# Altium schematic sheet MicroMultimeter__Sch.SchDoc: MicroMultimeter
size 228 x 152 mm; Author: Hom; CompanyName: KitSprout; DrawnBy: Hom; Engineer: Hom; Organization: KitSprout; Revision: B; SheetNumber: 1; SheetTotal: 1; License: CC BY-SA 4.0; Version: 1.0; LibVersion: 1.3; PageSetup: Record=PageOptions|CenterHorizontal=True|CenterVertical=True|PrintScale=1.00|XCorrection=1.00|YCorrection=1.00|PrintKind=0|BorderSize=5000000|LeftOffset=0|BottomOffset=0|Orientation=2|PaperLength=1000|PaperWidth=1000|Scale=100|PaperSource=7|PrintQuality=-3|MediaType=1|DitherType=10|PrintScaleMode=0|PaperKind=A4|PaperIndex=9
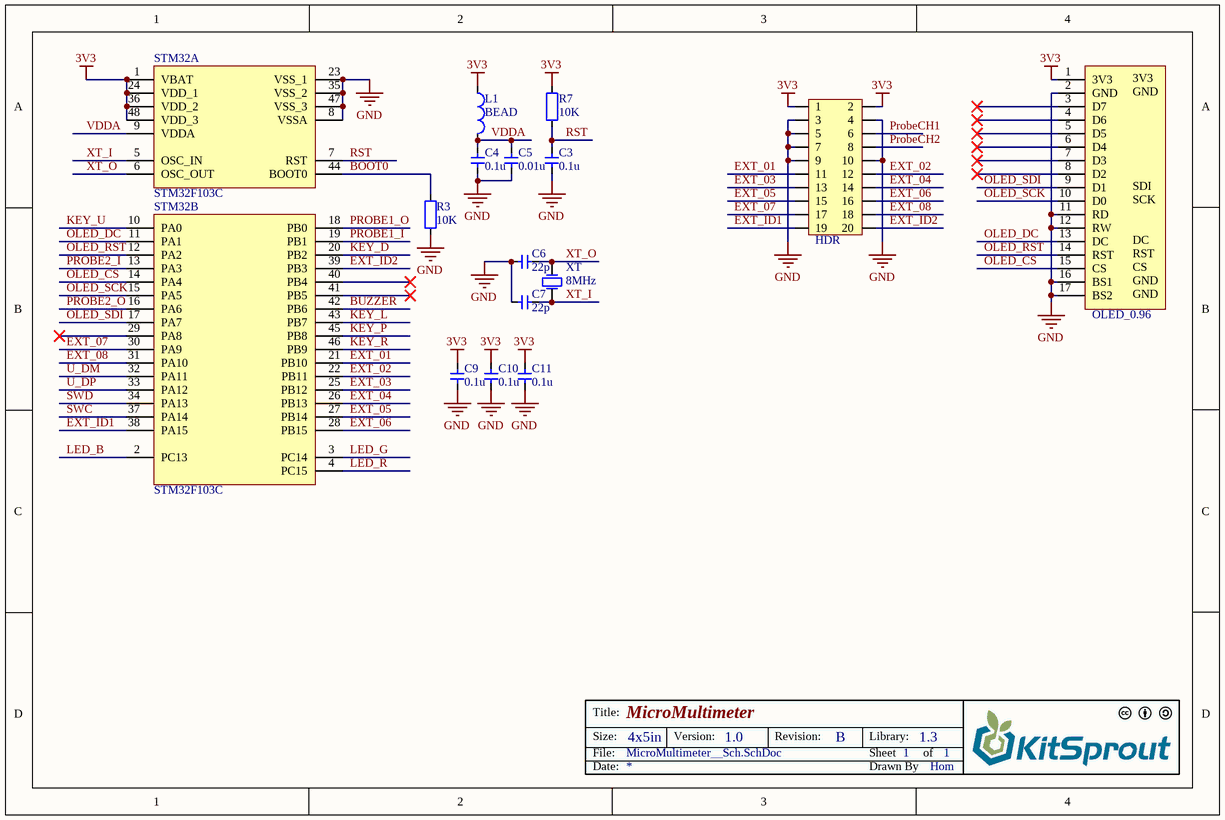
[diagram p0: MicroMultimeter__Sch.SchDoc]

## Parts
C3  value 0.1u  [CAP_0603]  (hidden comment: Cap_0603)
C4  value 0.1u  [CAP_0603]  (hidden comment: Cap_0603)
C5  value 0.01u  [CAP_0603]  (hidden comment: Cap_0603)
C6  value 22p  [CAP_0603]  (hidden comment: Cap_0603)
C7  value 22p  [CAP_0603]  (hidden comment: Cap_0603)
C9  value 0.1u  [CAP_0603]  (hidden comment: Cap_0603)
C10  value 0.1u  [CAP_0603]  (hidden comment: Cap_0603)
C11  value 0.1u  [CAP_0603]  (hidden comment: Cap_0603)
HDR  HDR2x10_2.54  [HDR2X10_2.54_180HF]  (value not drawn)
L1  value BEAD  [IND_0603]  (hidden comment: Ind_0603)
OLED_0.96  OLED_0.96  [OLED_0.96_96x64]  (value not drawn)
R3  value 10K  [RES_0603]  (hidden comment: Res_0603)
R7  value 10K  [RES_0603]  (hidden comment: Res_0603)
STM32  STM32F103C  [LQFP_P0.5_48]  (parts A,B of 2)
XT  value 8MHz  [XT_5032_2]  (hidden comment: XTAL_5032_2P)

## Nets
3V3: C9.2 C10.2 C11.2 HDR.1 HDR.2 L1.1 OLED_0.96.1(3V3) R7.2 STM32.1(VBAT) STM32.24(VDD_1) STM32.36(VDD_2) STM32.48(VDD_3)
GND: C3.1 C4.1 C5.1 C6.2 C7.2 C9.1 C10.1 C11.1 HDR.3 HDR.4 HDR.5 HDR.7 HDR.9 HDR.10 OLED_0.96.2(GND) OLED_0.96.11(RD) OLED_0.96.12(RW) OLED_0.96.16(BS1) OLED_0.96.17(BS2) R3.1 STM32.8(VSSA) STM32.23(VSS_1) STM32.35(VSS_2) STM32.47(VSS_3)
BOOT0: R3.2 STM32.44(BOOT0)
BUZZER: STM32.42(PB6)
EXT_01: HDR.11 STM32.21(PB10)
EXT_02: HDR.12 STM32.22(PB11)
EXT_03: HDR.13 STM32.25(PB12)
EXT_04: HDR.14 STM32.26(PB13)
EXT_05: HDR.15 STM32.27(PB14)
EXT_06: HDR.16 STM32.28(PB15)
EXT_07: HDR.17 STM32.30(PA9)
EXT_08: HDR.18 STM32.31(PA10)
EXT_ID1: HDR.19 STM32.38(PA15)
EXT_ID2: HDR.20 STM32.39(PB3)
KEY_D: STM32.20(PB2)
KEY_L: STM32.43(PB7)
KEY_P: STM32.45(PB8)
KEY_R: STM32.46(PB9)
KEY_U: STM32.10(PA0)
LED_B: STM32.2(PC13)
LED_G: STM32.3(PC14)
LED_R: STM32.4(PC15)
OLED_CS: OLED_0.96.15(CS) STM32.14(PA4)
OLED_DC: OLED_0.96.13(DC) STM32.11(PA1)
OLED_RST: OLED_0.96.14(RST) STM32.12(PA2)
OLED_SCK: OLED_0.96.10(D0) STM32.15(PA5)
OLED_SDI: OLED_0.96.9(D1) STM32.17(PA7)
PROBE1_I: STM32.19(PB1)
PROBE1_O: STM32.18(PB0)
PROBE2_I: STM32.13(PA3)
PROBE2_O: STM32.16(PA6)
ProbeCH1: HDR.6
ProbeCH2: HDR.8
RST: C3.2 R7.1 STM32.7(RST)
SWC: STM32.37(PA14)
SWD: STM32.34(PA13)
U_DM: STM32.32(PA11)
U_DP: STM32.33(PA12)
VDDA: C4.2 C5.2 L1.2 STM32.9(VDDA)
XT_I: C7.1 STM32.5(OSC_IN) XT.1(OSC1)
XT_O: C6.1 STM32.6(OSC_OUT) XT.2(OSC2)

Not connected (* = marked no-connect by the designer): OLED_0.96 3(D7)* 4(D6)* 5(D5)* 6(D4)* 7(D3)* 8(D2)*; STM32 29(PA8)* 40(PB4)* 41(PB5)*

## Notes on the sheet
- Title:
- Size:
- Date:
- File:
- 4x5in
- Version:
- Revision:
- Sheet
- Drawn By
- Library:
- of
- (in symbol OLED_0.96_96*64) SDI; SCK

## Library data of the parts
C3-C7 C9-C11 = Cap_0603: Capacitor
HDR = HDR2x10_2.54: Header
L1 = Ind_0603: Inductor
OLED_0.96 = OLED_0.96_96*64: Module
R3 R7 = Res_0603: Resistor
STM32 = STM32F103C: MCU
XT = XTAL_5032_2P: Crystal Oscillator